# Altium schematic sheet Acceleration.SchDoc
size 420 x 297 mm; SheetNumber: 10; SheetTotal: 11
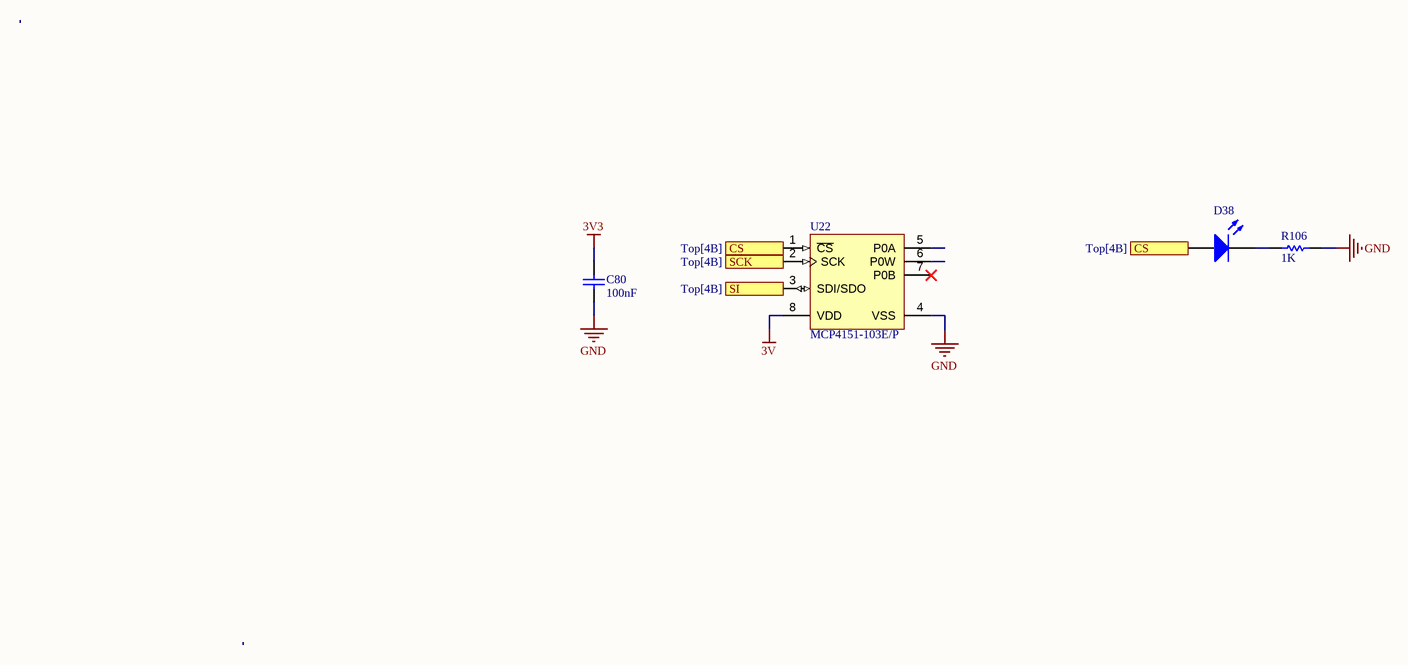
[diagram p0: Acceleration.SchDoc]

## Parts
C80  value 100nF  (hidden comment: Capacitor)
D38  Light-Emitting Diode  (value not drawn)
R106  value 1K  (hidden comment: Resistor)
U22  MCP4151-103E/P  [PDIP300-P8]

## Ports
CS (in, see Top[4B]), SCK (in, see Top[4B]), SI (in, see Top[4B])

## Nets
3V: U22.8(VDD)
3V3: C80.2
GND: C80.1 R106.2 U22.4(VSS)
CS: D38.1(A) U22.1(~{CS}) ; port CS
SCK: U22.2(SCK) ; port SCK
SI: U22.3(SDI/SDO) ; port SI
NetD38_2: D38.2(K) R106.1

Not connected (* = marked no-connect by the designer): U22 5(P0A) 6(P0W) 7(P0B)*

## Notes on the sheet
- THIS DOCUMENT AND THE DATA DISCLOSED HEREIN OR
- HEREWITH IS THE PROPERTY OF ALTIUM LIMITED AND MAY
- DWG NO:
- REVISION
- REV:
- DESCRIPTION
- DATE
- APPROVED
- BE FREELY DISTRIBUTED IN WHOLE. NO RIGHTS ARE
- RESERVED OR EXPRESS OR IMPLIED WARANTEE GIVEN.
- ENG:
- APPROVALS
- PROJECT
- DSN:
- CHK:
- REFERENCE DOCUMENTS
- PROJECT REVISION:
- TITLE
- DOCUMENT REVISION:
- DESIGN ITEM:
- BOM:
- FAB DWG:
- PCB DWG:
- ASSY DWG:
- SCALE:
- A3
- SIZE
- CAGE CODE
- FILE NAME
- DWG NO.
- SHEET
- OF
- REV

## Library data of the parts
C80 = Capacitor: SimulationGenericComponent: True; Supplier 1: Arrow Electronics
D38 = LED: AF: 1; BV: 0; BV_MAX: 1e99; EG: 1.11; FC: 0.5; IBV: 0.001; IS: 1e-14; MJSW: 0.33; NTUN: 30; TNOM: 27; XTI: 3; SimulationGenericComponent: True; CJO: 0; CJP: 0; CTA: 0; CTP: 0; FCS: 0.5; FV_MAX: 1e99; IKF: 0; IKR: 0; ISR: 1e-14; JSW: 0; JTUN: 0; JTUNSW: 0; KEG: 1; KF: 0; LEVEL: 1; N: 1; NBV: 1; NR: 1; NS: 1; PHP: 1; RS: 0; TCV: 0; TLEV: 0; TLEVC: 0; TM1: 0; TM2: 0; TPB: 0; TPHP: 0; TRS: 0; TRS2: 0; TT: 0; TTT1: 0; TTT2: 0; VJ: 1; XTITUN: 3
R106 = Resistor: TC1: 0; SimulationGenericComponent: True; TC2: 0
U22 = CMP-0188-00257-2: 7/8-Bit Single/Dual SPI Digital POT with Volatile Memory, 8-Pin PDIP, Extended Temperature; RevisionNote: URLs added.; PackageReference: PDIP300-P8; ComponentLink1Description: Manufacturer URL; ComponentLink3URL: http://www.microchip.com/stellent/groups/techpub_sg/documents/packagingspec/en012702.pdf; PackageDescription: 8-Lead Plastic Dual In-Line (P) - 300 mil Body [PDIP]; ComponentLink2Description: Datasheet; Code_JEDEC: MS-001; ComponentLink2URL: http://ww1.microchip.com/downloads/en/DeviceDoc/22060b.pdf; DatasheetVersion: revB, Dec-2008; ComponentLink1URL: http://www.microchip.com/; ComponentLink3Description: Package Specification; PackageVersion: revBB, Aug-2009